# EAGLE design eprom-programmer3 (EAGLE 7.5.0)
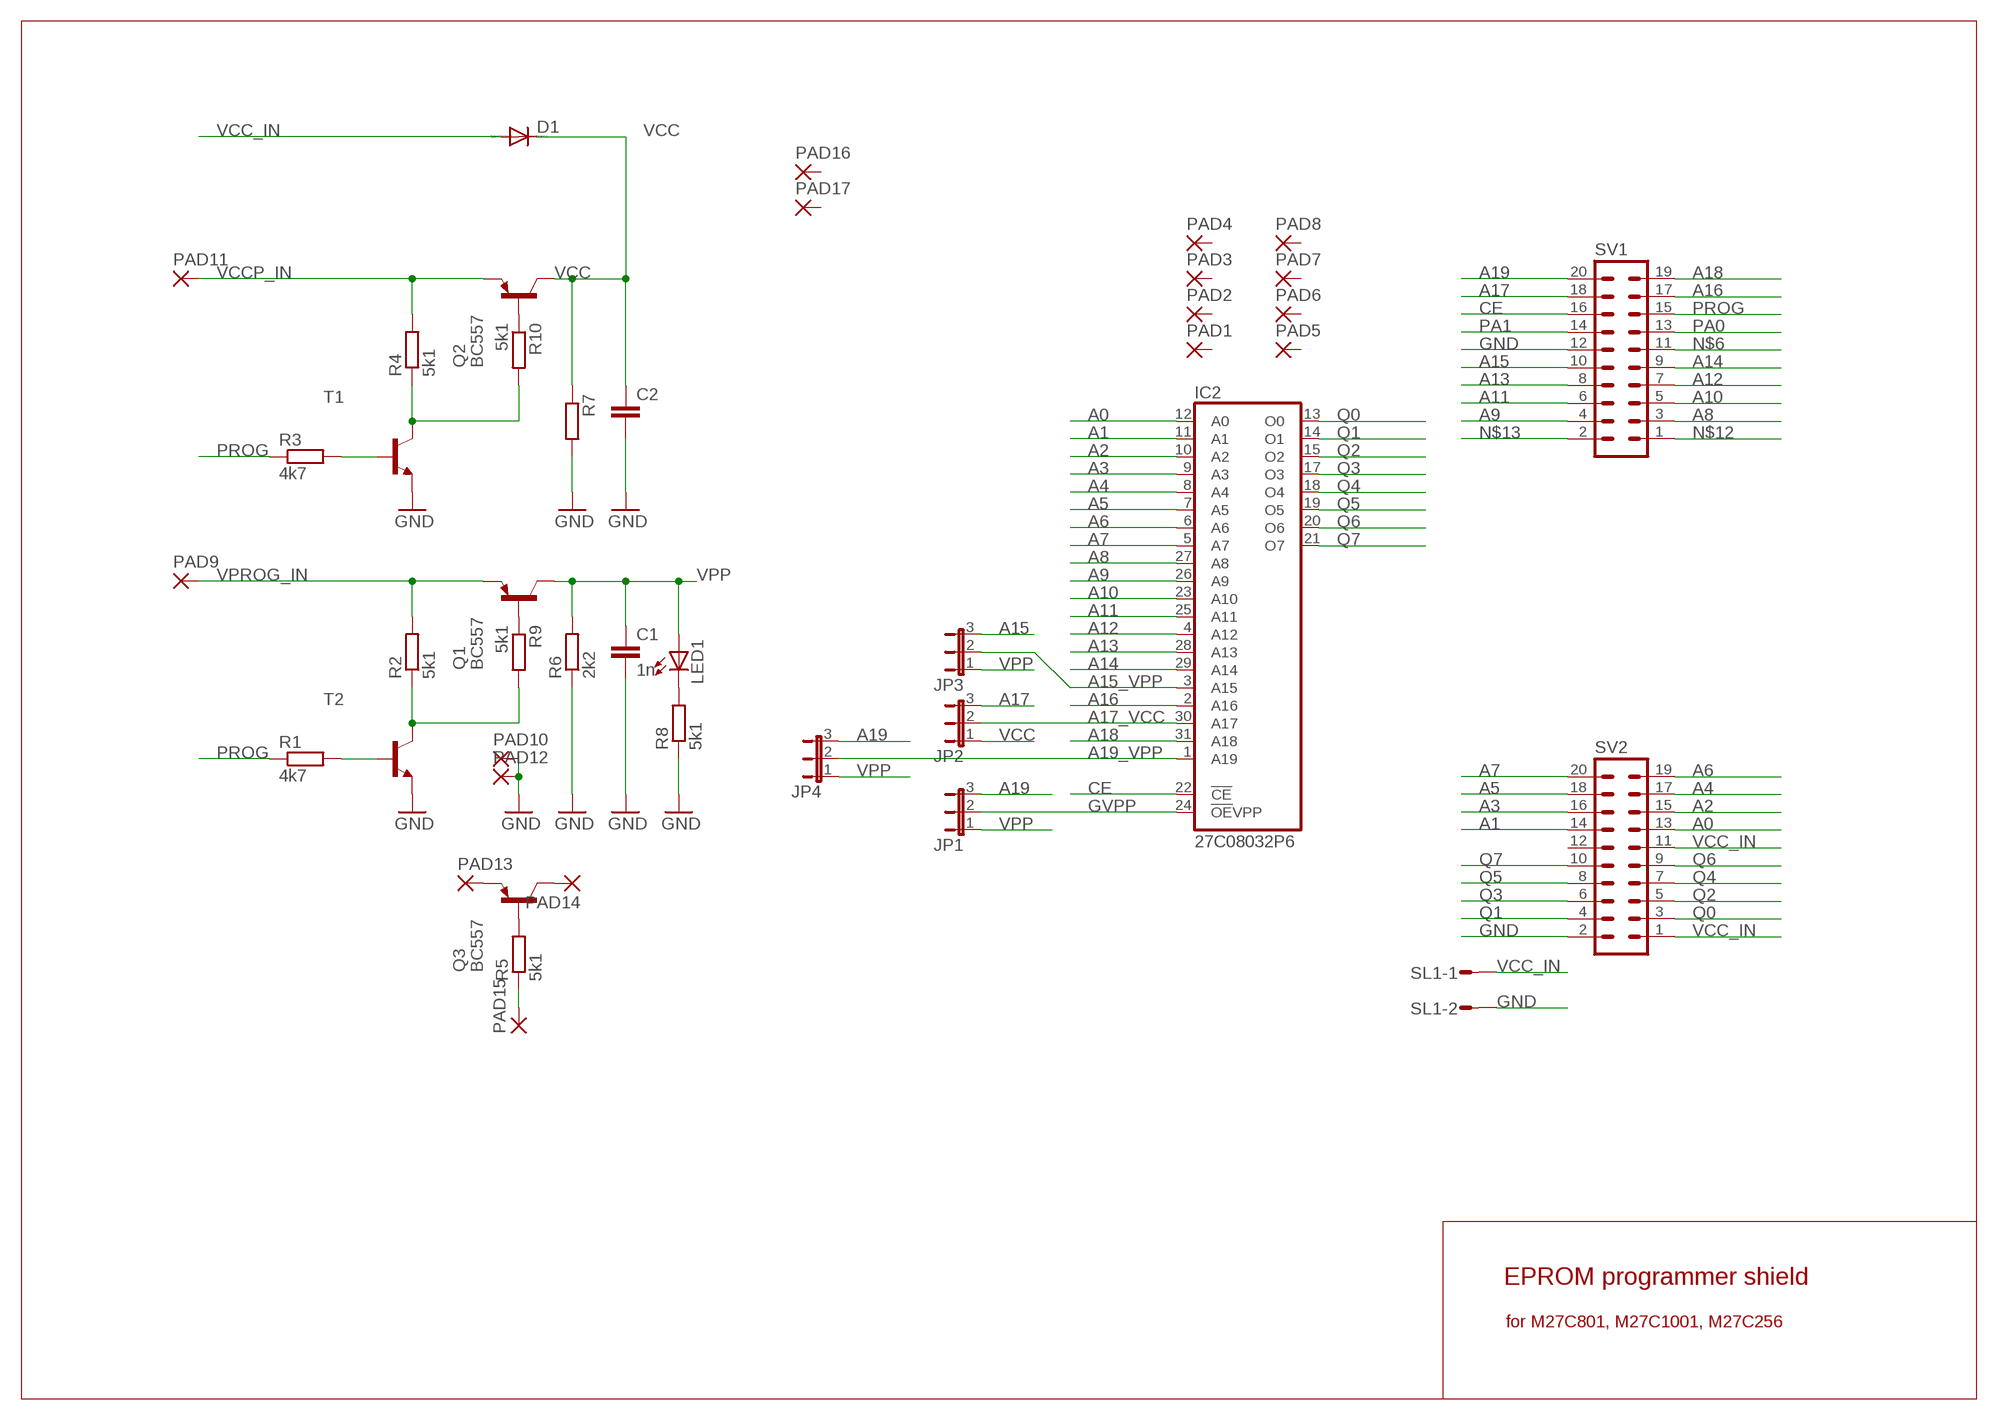
[diagram p0: schematic, sheet 1]

## Parts
C1  1n  C-EU025-024X044  [C025-024X044]
C2  C-EUC0805  [C0805]
D1  DIODE-MINIMELF  [MINIMELF]
IC2  27C08032P6  [DIL32]
JP1  JP2E  [JP2]
JP2  JP2E  [JP2]
JP3  JP2E  [JP2]
JP4  JP2E  [JP2]
LED1  LED3MM  [LED3MM]
PAD1  1,6/0,8  [1,6/0,8]
PAD2  1,6/0,8  [1,6/0,8]
PAD3  1,6/0,8  [1,6/0,8]
PAD4  1,6/0,8  [1,6/0,8]
PAD5  1,6/0,8  [1,6/0,8]
PAD6  1,6/0,8  [1,6/0,8]
PAD7  1,6/0,8  [1,6/0,8]
PAD8  1,6/0,8  [1,6/0,8]
PAD9  1,6/0,8  [1,6/0,8]
PAD10  1,6/0,8  [1,6/0,8]
PAD11  1,6/0,8  [1,6/0,8]
PAD12  1,6/0,8  [1,6/0,8]
PAD13  1,6/0,8  [1,6/0,8]
PAD14  1,6/0,8  [1,6/0,8]
PAD15  1,6/0,8  [1,6/0,8]
PAD16  1,6/0,8  [1,6/0,8]
PAD17  1,6/0,8  [1,6/0,8]
Q1  BC557  [TO92-EBC]
Q2  BC557  [TO92-EBC]
Q3  BC557  [TO92-EBC]
R1  4k7  R-EU_0207/2V  [0207/2V]
R2  5k1  R-EU_0207/2V  [0207/2V]
R3  4k7  R-EU_0207/2V  [0207/2V]
R4  5k1  R-EU_0207/2V  [0207/2V]
R5  5k1  R-EU_0207/2V  [0207/2V]
R6  2k2  R-EU_0207/2V  [0207/2V]
R7  R-EU_M0805  [M0805]
R8  5k1  R-EU_0207/2V  [0207/2V]
R9  5k1  R-EU_M0805  [M0805]
R10  5k1  R-EU_M0805  [M0805]
SL1  MA02S  [02PA]
SV1  MA10-2  [MA10-2]
SV2  MA10-2  [MA10-2]
T1  BC547-NPN-TO92-CBE  [TO92-CBE]
T2  BC547-NPN-TO92-CBE  [TO92-CBE]

## Nets
A0: IC2.12(A0) SV2.13
A1: IC2.11(A1) SV2.14
A2: IC2.10(A2) SV2.15
A3: IC2.9(A3) SV2.16
A4: IC2.8(A4) SV2.17
A5: IC2.7(A5) SV2.18
A6: IC2.6(A6) SV2.19
A7: IC2.5(A7) SV2.20
A8: IC2.27(A8) SV1.3
A9: IC2.26(A9) SV1.4
A10: IC2.23(A10) SV1.5
A11: IC2.25(A11) SV1.6
A12: IC2.4(A12) SV1.7
A13: IC2.28(A13) SV1.8
A14: IC2.29(A14) SV1.9
A15: JP3.3 SV1.10
A15_VPP: IC2.3(A15) JP3.2
A16: IC2.2(A16) SV1.17
A17: JP2.3 SV1.18
A17_VCC: IC2.30(A17) JP2.2
A18: IC2.31(A18) SV1.19
A19: JP1.3 JP4.3 SV1.20
A19_VPP: IC2.1(A19) JP4.2
CE: IC2.22(!CE) SV1.16
GND: C1.2 C2.2 PAD10.1(P) PAD12.1(P) R6.1 R7.2 R8.1 SL1.2 SV1.12 SV2.2 T1.E T2.E
GVPP: IC2.24(!OE!VPP) JP1.2
N$1: R3.2 T1.B
N$2: R4.1 R10.2 T1.C
N$3: R1.2 T2.B
N$4: R2.1 R9.2 T2.C
N$5: Q3.B R5.2
N$6: SV1.11
N$7: PAD13.1(P) Q3.E
N$8: PAD14.1(P) Q3.C
N$9: PAD15.1(P) R5.1
N$10: LED1.K(C) R8.2
N$11: Q1.B R9.1
N$12: SV1.1
N$13: SV1.2
N$14: Q2.B R10.1
PA0: SV1.13
PA1: SV1.14
PROG: R1.1 R3.1 SV1.15
Q0: IC2.13(O0) SV2.3
Q1: IC2.14(O1) SV2.4
Q2: IC2.15(O2) SV2.5
Q3: IC2.17(O3) SV2.6
Q4: IC2.18(O4) SV2.7
Q5: IC2.19(O5) SV2.8
Q6: IC2.20(O6) SV2.9
Q7: IC2.21(O7) SV2.10
VCC: C2.1 D1.C JP2.1 Q2.C R7.1
VCC_IN: D1.A SL1.1 SV2.1 SV2.11
VCCP_IN: PAD11.1(P) Q2.E R4.2
VPP: C1.1 JP1.1 JP3.1 JP4.1 LED1.A Q1.C R6.2
VPROG_IN: PAD9.1(P) Q1.E R2.2
Unconnected: PAD1.1(P) PAD2.1(P) PAD3.1(P) PAD4.1(P) PAD5.1(P) PAD6.1(P) PAD7.1(P) PAD8.1(P) PAD16.1(P) PAD17.1(P) SV2.12

## Notes on the sheet
- EPROM programmer shield
- for M27C801, M27C1001, M27C256

## Power pins joined to a net without a drawn wire
GND: IC2.16(GND)
VCC: IC2.32(VCC)

## Library data of the parts
C1 C2 = rcl:C-EU: CAPACITOR, European symbol
D1 = diode:DIODE-: DIODE
IC2 = atmel:27C080: 8-Megabit (1Mx8) OTP EPROM; MPN: AT27C080-90PU; OC_FARNELL: 1455026; OC_NEWARK: 58M3824
JP1-JP4 = jumper:JP2E: JUMPER
LED1 = led:LED: LED OSRAM: - CHIPLED LG R971, LG N971, LY N971, LG Q971, LY Q971, LO R971, LY R971 LH N974, LH R974 LS Q976, LO Q976, LY Q976 LO Q996 - Hyper CHIPLED LW Q18S LB Q993, LB Q99A, LB R99A - SideLED LS A670, LO A670, LY A670, LG A670, LP A670 LB A673, LV A673, LT A673, LW A673 LH A674 LY A675 LS A676, LA A676, LO A676, LY A676, LW A676 LS A679, LY A679, LG A679 - Hyper Micro SIDELED® LS Y876, LA Y876, LO Y876, LY Y876 LT Y87S - SmartLED LW L88C, LW L88S LB L89C, LB L89S, LG L890 LS L89K, LO L89K, LY L89K LS L896, LA L896, LO L896, LY L896 - TOPLED LS T670, LO T670, LY T670, LG T670, LP T670 LSG T670, LSP T670, LSY T670, LOP T670, LYG T670 LG T671, LOG T671, LSG T671 LB T673, LV T673, LT T673, LW T673 LH T674 LS T676, LA T676, LO T676, LY T676, LB T676, LH T676, LSB T676, LW T676 LB T67C, LV T67C, LT T67C, LS T67K, LO T67K, LY T67K, LW E67C LS E67B, LA E67B, LO E67B, LY E67B, LB E67C, LV E67C, LT E67C LW T67C LS T679, LY T679, LG T679 LS T770, LO T770, LY T770, LG T770, LP T770 LB T773, LV T773, LT T773, LW T773 LH T774 LS E675, LA E675, LY E675, LS T675 LS T776, LA T776, LO T776, LY T776, LB T776 LHGB T686 LT T68C, LB T68C - Hyper Mini TOPLED® LB M676 - Mini TOPLED Santana® LG M470 LS M47K, LO M47K, LY M47K Source: http://www.osram.convergy.de LUXEON: - LUMILED® LXK2-PW12-R00, LXK2-PW12-S00, LXK2-PW14-U00, LXK2-PW14-V00 LXK2-PM12-R00, LXK2-PM12-S00, LXK2-PM14-U00 LXK2-PE12-Q00, LXK2-PE12-R00, LXK2-PE12-S00, LXK2-PE14-T00, LXK2-PE14-U00 LXK2-PB12-K00, LXK2-PB12-L00, LXK2-PB12-M00, LXK2-PB14-N00, LXK2-PB14-P00, LXK2-PB14-Q00 LXK2-PR12-L00, LXK2-PR12-M00, LXK2-PR14-Q00, LXK2-PR14-R00 LXK2-PD12-Q00, LXK2-PD12-R00, LXK2-PD12-S00 LXK2-PH12-R00, LXK2-PH12-S00 LXK2-PL12-P00, LXK2-PL12-Q00, LXK2-PL12-R00 Source: www.luxeon.com KINGBRIGHT: KA-3528ASYC Source: www.kingbright.com
PAD1-PAD17 = wirepad:1,6/0,8: THROUGH-HOLE PAD
Q1-Q3 = transistor-pnp:BC557*: PNP Transistror
R1-R10 = rcl:R-EU_: RESISTOR, European symbol
SL1 = con-amp-quick:MA02S: AMP QUICK CONNECTOR; OC_FARNELL: unknown; OC_NEWARK: unknown
SV1 SV2 = con-lstb:MA10-2: PIN HEADER; OC_FARNELL: unknown; OC_NEWARK: unknown
T1 T2 = transistor:*-NPN-: NPN Transistror BF959 corrected 2008.03.06

## Board
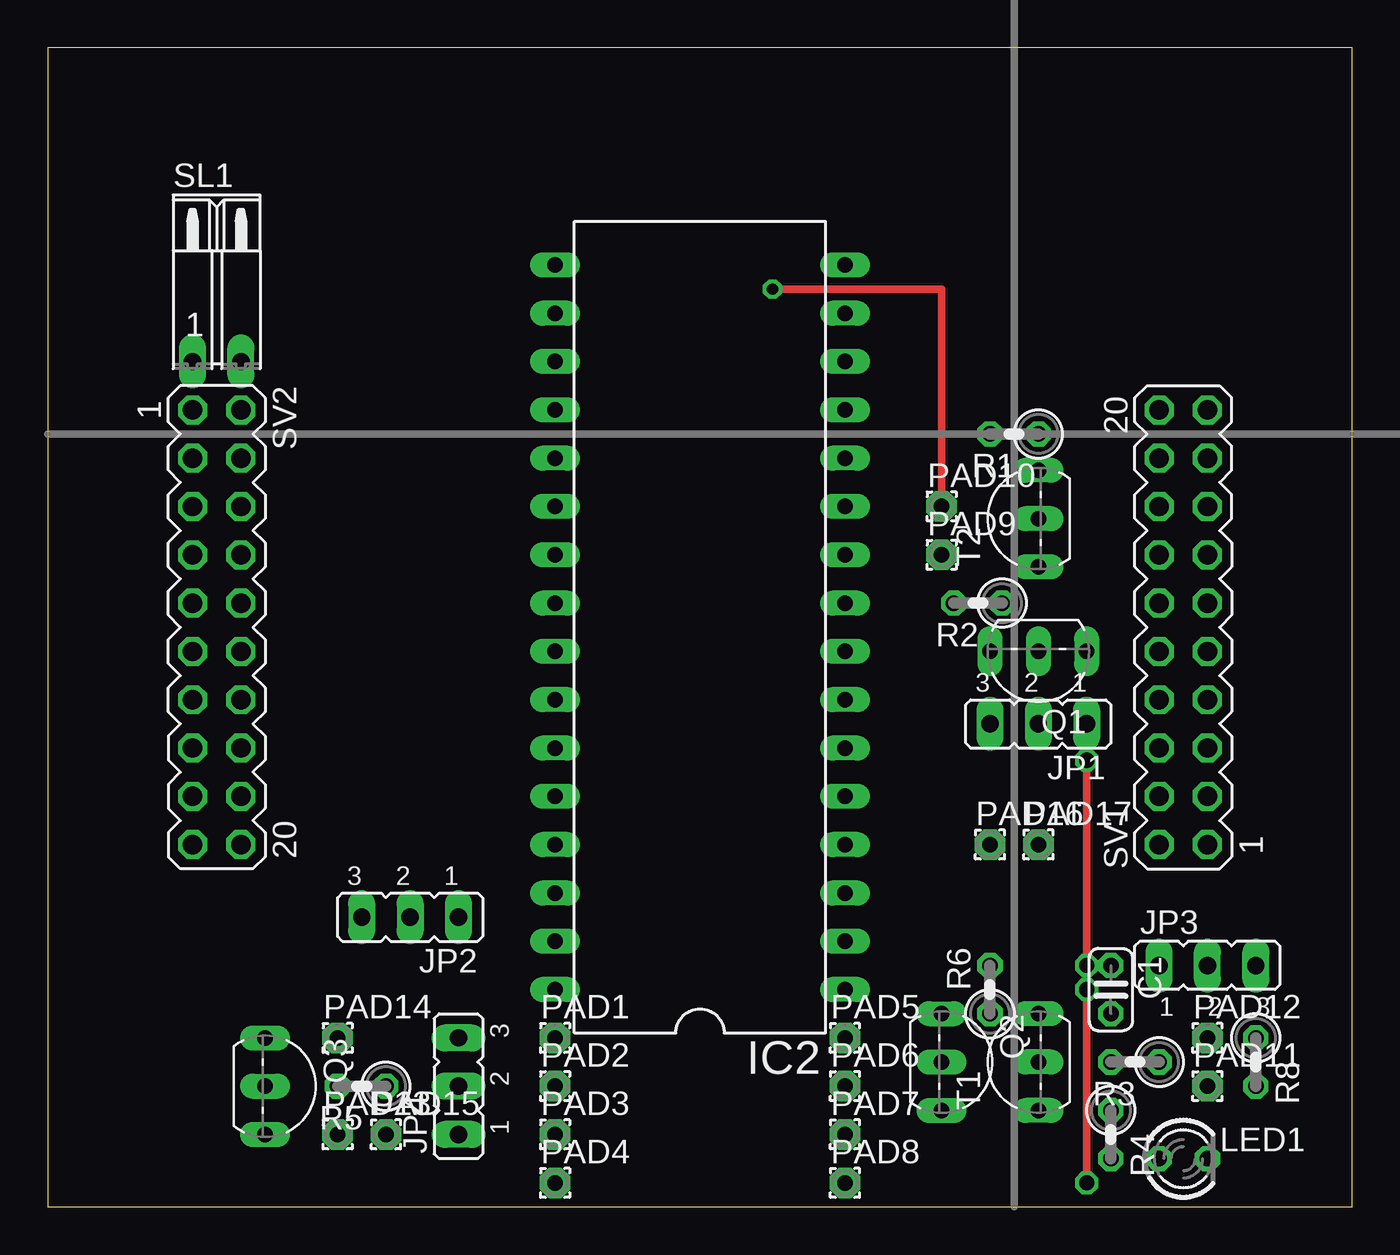
[diagram p1: board, top side]
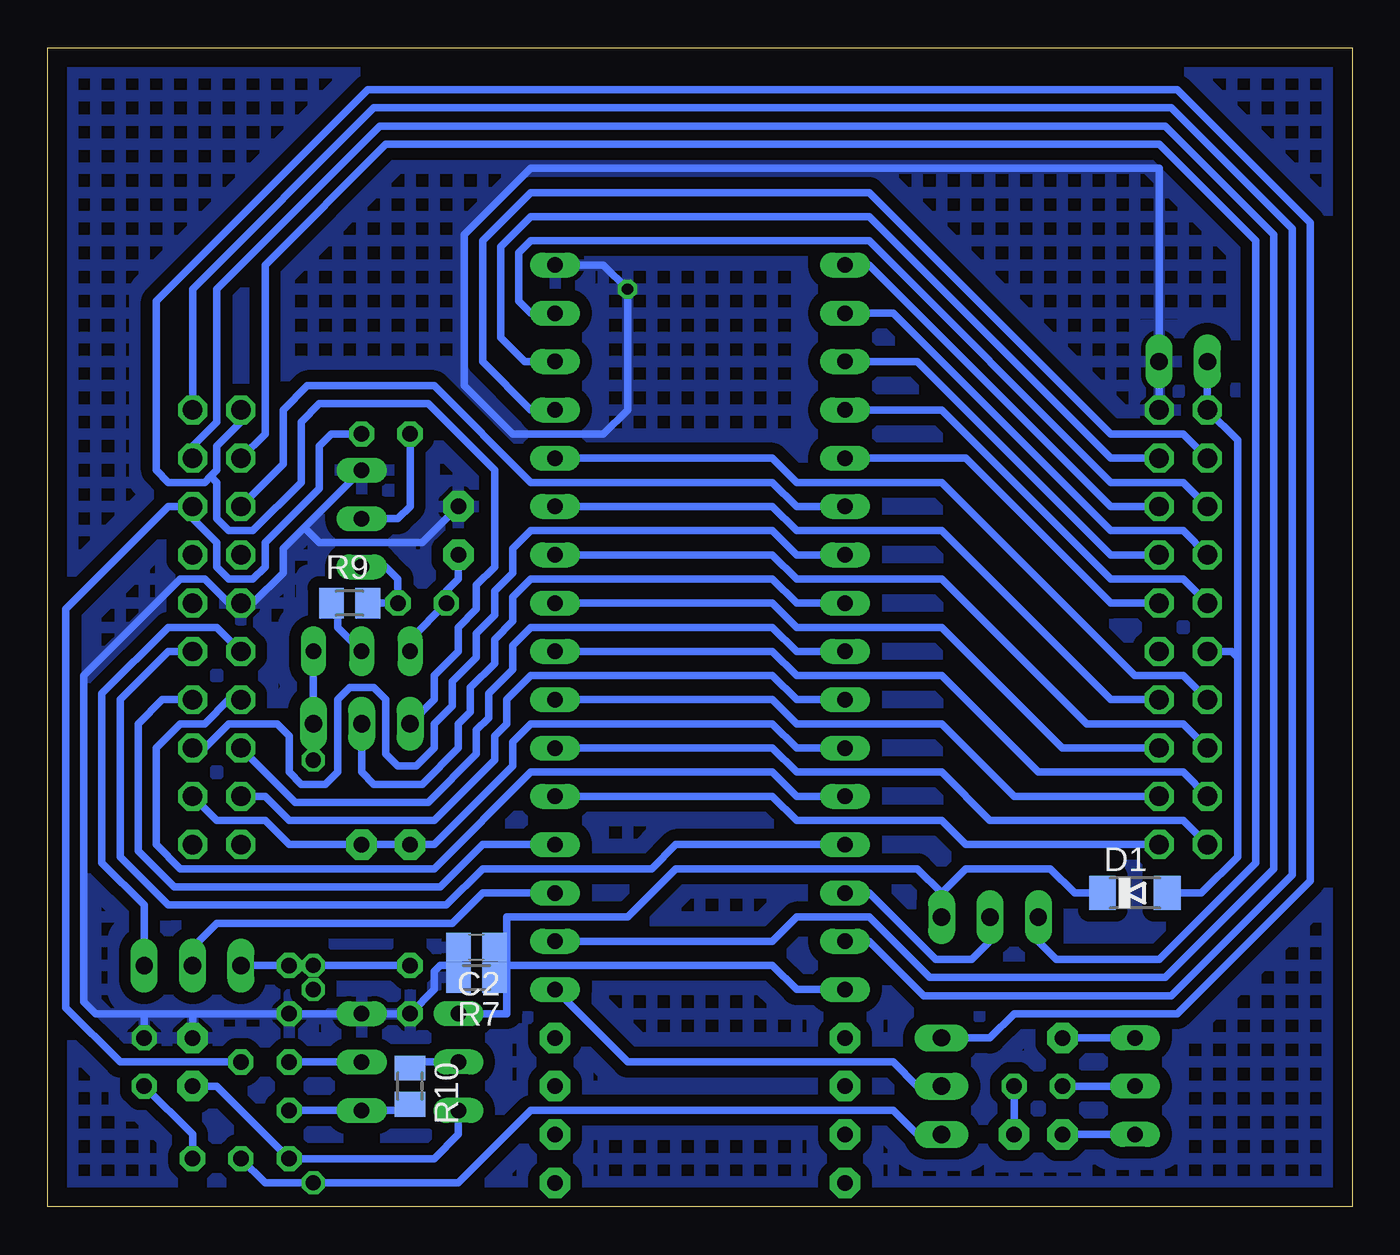
[diagram p2: board, bottom side, seen from below]

Size 68.58 x 60.96 mm. Coordinates in mm from the lower left corner, seen from the top.
Outline: 0,0 68.58,0 68.58,60.96 0,60.96 0,0
Copper layers (1*16): Top 0.035mm / dielectric 1.5mm / Bottom 0.035mm
Design rules "default": minimum track width 10mil, minimum drill 24mil, track to track 8mil, track to pad 8mil, pad to pad 8mil, via to via 8mil, smd to smd 8mil, copper to edge 40mil, drill to drill 8mil, minimum pad ring 10mil, minimum via ring 8mil, stop-mask expansion 4mil, vias tented up to drill 0mil, thermal gap 10mil
tKeepout: 4 lines

### Footprints (pad centres in the part's own frame; a part is rotated, then mirrored left to right if it is on the bottom)
C025-024X044 = drill 0.813 octagon: 1 -1.27,0; 2 1.27,0
C0805 = smd 1.3 x 1.5: 1 -0.95,0; 2 0.95,0
MINIMELF = smd 1.4 x 1.8: A 1.7,0; C -1.7,0
DIL32 = drill 0.813 long: 1 -19.05,-7.62; 2 -16.51,-7.62; 3 -13.97,-7.62; 4 -11.43,-7.62; 5 -8.89,-7.62; 6 -6.35,-7.62; 7 -3.81,-7.62; 8 -1.27,-7.62; 9 1.27,-7.62; 10 3.81,-7.62; 11 6.35,-7.62; 12 8.89,-7.62; 13 11.43,-7.62; 14 13.97,-7.62; 15 16.51,-7.62; 16 19.05,-7.62; 17 19.05,7.62; 18 16.51,7.62; 19 13.97,7.62; 20 11.43,7.62; 21 8.89,7.62; 22 6.35,7.62; 23 3.81,7.62; 24 1.27,7.62; 25 -1.27,7.62; 26 -3.81,7.62; 27 -6.35,7.62; 28 -8.89,7.62; 29 -11.43,7.62; 30 -13.97,7.62; 31 -16.51,7.62; 32 -19.05,7.62
JP2 = drill 0.914 long: 1 -2.54,0; 2 0,0; 3 2.54,0
LED3MM = drill 0.813 octagon: A -1.27,0; K 1.27,0
1,6/0,8 = drill 0.813 pad 1.6 octagon: 1 0,0
TO92-EBC = drill 0.813 long: B 0,-1.27; C -2.54,-1.27; E 2.54,-1.27
0207/2V = drill 0.813 octagon: 1 -1.27,0; 2 1.27,0
M0805 = smd 1.3 x 1.6: 1 -0.95,0; 2 0.95,0
02PA = drill 0.914 long: 1 -1.27,0; 2 1.27,0
MA10-2 = drill 1.016 octagon: 1 -11.43,-1.27; 2 -11.43,1.27; 3 -8.89,-1.27; 4 -8.89,1.27; 5 -6.35,-1.27; 6 -6.35,1.27; 7 -3.81,-1.27; 8 -3.81,1.27; 9 -1.27,-1.27; 10 -1.27,1.27; 11 1.27,-1.27; 12 1.27,1.27; 13 3.81,-1.27; 14 3.81,1.27; 15 6.35,-1.27; 16 6.35,1.27; 17 8.89,-1.27; 18 8.89,1.27; 19 11.43,-1.27; 20 11.43,1.27
TO92-CBE = drill 0.813 long: B 0,0; C -2.54,0; E 2.54,0

### Placement (x,y rotation side)
C1  55.88,11.43 270 top
C2  46.04,13.65 180 bottom
D1  11.43,16.51 0 bottom
IC2  34.29,30.48 90 top
JP1  52.07,25.4 180 top
JP2  19.05,15.24 180 top
JP3  60.96,12.7 0 top
JP4  21.59,6.35 90 top
LED1  59.69,2.54 0 top
PAD1  26.67,8.89 0 top
PAD2  26.67,6.35 0 top
PAD3  26.67,3.81 0 top
PAD4  26.67,1.27 0 top
PAD5  41.91,8.89 0 top
PAD6  41.91,6.35 0 top
PAD7  41.91,3.81 0 top
PAD8  41.91,1.27 0 top
PAD9  46.99,34.29 0 top
PAD10  46.99,36.83 0 top
PAD11  60.96,6.35 0 top
PAD12  60.96,8.89 0 top
PAD13  15.24,3.81 0 top
PAD14  15.24,8.89 0 top
PAD15  17.78,3.81 0 top
PAD16  49.53,19.05 0 top
PAD17  52.07,19.05 0 top
Q1  52.07,27.94 180 top
Q2  48.26,7.62 270 top
Q3  12.7,6.35 270 top
R1  50.8,40.64 180 top
R2  48.9,31.75 180 top
R3  57.15,7.62 180 top
R4  55.88,3.81 270 top
R5  16.51,6.35 180 top
R6  49.53,11.43 90 top
R7  46.04,12.06 180 bottom
R8  63.5,7.62 270 top
R9  52.7,31.75 0 bottom
R10  49.53,6.35 270 bottom
SL1  8.89,44.45 0 top
SV1  59.69,30.48 90 top
SV2  8.89,30.48 270 top
T1  52.07,7.62 90 top
T2  52.07,36.2 90 top

### Tracks (layer width: path | path; a pad name or v marks a point on that pad's centre or on a via)
A0
  Bottom 0.406: IC2.12 30.48,39.37 29.21,38.1 21.59,38.1 11.43,27.94 8.89,27.94 SV2.13
A1
  Bottom 0.406: SV2.14 12.7,26.67 21.59,35.56 29.21,35.56 30.48,36.83 IC2.11
A2
  Bottom 0.406: SV2.15 8.89,25.4 13.97,25.4 21.59,33.02 29.21,33.02 30.48,34.29 IC2.10
A3
  Bottom 0.406: SV2.16 15.24,24.13 21.59,30.48 29.21,30.48 30.48,31.75 IC2.9
A4
  Bottom 0.406: SV2.17 8.89,22.86 16.51,22.86 21.59,27.94 29.21,27.94 30.48,29.21 IC2.8
A5
  Bottom 0.406: SV2.18 17.78,21.59 21.59,25.4 29.21,25.4 30.48,26.67 IC2.7
A6
  Bottom 0.406: SV2.19 8.89,20.32 19.05,20.32 21.59,22.86 29.21,22.86 30.48,24.13 IC2.6
A7
  Bottom 0.406: SV2.20 20.32,19.05 21.59,20.32 29.21,20.32 30.48,21.59 IC2.5
A8
  Bottom 0.406: IC2.27 29.21,24.13 30.48,25.4 43.18,25.4 44.13,24.45 44.13,23.18 48.26,19.05 55.88,19.05 57.15,20.32 59.69,20.32 SV1.3
A9
  Bottom 0.406: IC2.26 29.21,26.67 30.48,27.94 43.18,27.94 44.45,26.67 44.45,25.4 45.09,24.77 45.09,23.5 48.26,20.32 55.88,20.32 57.15,21.59 SV1.4
A10
  Bottom 0.406: IC2.23 29.21,34.29 30.48,35.56 43.18,35.56 44.13,34.61 44.13,33.34 45.09,32.38 45.09,31.11 46.04,30.16 46.04,28.89 47.31,27.62 47.31,26.35 48.26,25.4 48.26,24.13 49.21,23.18 50.16,23.18 50.8,23.81 50.8,26.67 51.44,27.3 52.7,27.3 53.34,26.67 53.34,22.86 53.98,22.23 55.24,22.23 55.88,22.86 55.88,24.77 56.52,25.4 59.05,25.4 60.33,24.13 SV1.5
A11
  Bottom 0.406: IC2.25 29.21,29.21 30.48,30.48 43.18,30.48 44.13,29.53 44.13,28.26 45.4,26.99 45.4,25.72 46.04,25.08 46.04,23.81 48.58,21.27 55.56,21.27 SV1.6
A12
  Bottom 0.406: SV1.7 62.55,26.67 63.82,25.4 63.82,18.73 61.91,16.83 47.94,16.83 45.72,19.05 IC2.4
A13
  Bottom 0.406: IC2.28 29.21,21.59 30.48,22.86 43.18,22.86 48.26,17.78 61.59,17.78 62.87,19.05 62.87,24.13 61.59,25.4 60.33,25.4 59.05,26.67 SV1.8
A14
  Bottom 0.406: IC2.29 35.56,19.05 36.83,17.78 45.72,17.78 47.62,15.88 62.23,15.88 64.77,18.41 64.77,26.67 62.23,29.21 SV1.9
A15
  Bottom 0.406: SV1.10 59.69,30.48 62.23,30.48 65.72,26.99 65.72,18.1 63.5,15.88 JP3.3
A15_VPP
  Bottom 0.406: IC2.3 45.72,16.51 47.31,14.92 59.69,14.92 60.96,13.65 JP3.2
A16
  Bottom 0.406: IC2.2 30.48,13.97 29.21,15.24 25.4,15.24 22.23,12.06 9.84,12.06 4.13,17.78 4.13,51.12 9.84,56.83 51.12,56.83 59.69,48.26 59.69,41.27 60.96,40.01 SV1.17
A17
  Bottom 0.406: SV1.18 57.15,40.64 57.15,49.53 50.8,55.88 10.16,55.88 5.08,50.8 5.08,18.1 10.16,13.02 15.56,13.02 16.51,13.97 JP2.3
A17_VCC
  Bottom 0.406: IC2.30 25.4,16.51 21.91,13.02 20,13.02 19.05,13.97 JP2.2
A18
  Bottom 0.406: SV1.19 60.96,48.26 51.44,57.78 9.53,57.78 3.17,51.44 3.17,17.46 9.53,11.11 22.54,11.11 25.4,13.97 IC2.31
A19
  Bottom 0.406: SV1.20 58.42,41.27 59.69,40.01 59.69,38.73 60.01,38.42 | 60.01,38.42 60.33,38.1 62.23,38.1 62.87,38.73 62.87,47.62 51.75,58.74 9.21,58.74 2.22,51.75 2.22,17.14 9.21,10.16 17.78,10.16 19.05,8.89 JP4.3 | JP1.3 48.26,26.67 48.26,27.94 46.99,29.21 46.99,30.48 46.04,31.43 46.04,32.7 45.09,33.66 45.09,38.73 48.58,42.23 54.29,42.23 55.24,41.27 55.24,38.1 57.78,35.56 59.05,35.56 59.69,36.2 59.69,38.1 60.01,38.42
A19_VPP
  Bottom 0.406: IC2.1 38.1,7.62 24.13,7.62 22.86,6.35 JP4.2
CE
  Bottom 0.406: IC2.22 29.21,36.83 30.48,38.1 43.18,38.1 48.26,43.18 54.93,43.18 56.2,41.91 56.2,39.05 SV1.16
GND  (via drill 0.6)
  Top 0.406: PAD10.1 46.99,48.26 v38.1,48.26
  Bottom 0.406: IC2.16 39.37,49.53 v38.1,48.26 38.1,41.91 39.37,40.64 44.13,40.64 46.67,43.18 46.67,51.12 43.18,54.61 10.16,54.61 SL1.2 SV2.2 | T2.E 55.09,35.72 | 55.09,35.72 56.2,34.61 56.2,33.34 57.78,31.75 SV1.12 59.05,31.75 60.33,33.02 61.59,33.02 66.67,27.94 66.67,10.79 66.04,10.16 63.5,10.16 | PAD10.1 48.9,34.92 54.29,34.92 55.09,35.72 | 63.5,10.16 60.96,10.16 | 60.96,10.16 C1.2 T1.E R6.1 48.26,11.43 48.26,12.38 47.94,12.7 46.99,12.7 | PAD12.1 60.96,10.16 | C2.2 46.99,12.7 | 46.99,12.7 R7.2 | R8.1 63.5,10.16
  pour Bottom (isolate 0.61, hatched): 0,0 68.58,0 68.58,60.96 0,60.96
GVPP
  Bottom 0.406: IC2.24 29.21,31.75 30.48,33.02 43.18,33.02 44.13,32.07 44.13,30.8 45.09,29.84 45.09,28.57 46.35,27.3 46.35,26.04 46.99,25.4 46.99,24.13 48.9,22.23 51.44,22.23 52.07,22.86 JP1.2
N$1
  Bottom 0.406: T1.B R3.2
N$2
  Bottom 0.406: R4.1 T1.C 49.53,5.08 R10.2
N$3
  Bottom 0.406: T2.B 50.16,36.2 49.53,36.83 R1.2
N$4
  Bottom 0.406: T2.C 50.8,33.66 50.16,33.02 R2.1 R9.2
N$5
  Bottom 0.406: Q3.B R5.2
N$7
  Bottom 0.406: Q3.E PAD13.1
N$8
  Bottom 0.406: Q3.C PAD14.1
N$9
  Bottom 0.406: R5.1 PAD15.1
N$10
  Bottom 0.406: LED1.K 60.96,3.81 R8.2
N$11
  Bottom 0.406: R9.1 53.34,31.43 53.34,30.48 Q1.B
N$14
  Bottom 0.406: Q2.B 49.53,7.62 R10.1
PROG
  Bottom 0.406: R1.1 53.66,40.64 54.29,40.01 54.29,37.78 57.15,34.92 57.15,33.66 57.78,33.02 59.05,33.02 59.69,33.66 59.69,34.92 60.96,36.2 SV1.15 62.23,36.83 67.63,31.43 67.63,10.48 64.77,7.62 R3.1
Q0
  Bottom 0.406: SV2.3 8.89,40.64 12.7,40.64 25.4,53.34 43.18,53.34 45.72,50.8 45.72,44.45 43.18,41.91 IC2.13
Q1
  Bottom 0.406: SV2.4 12.7,39.37 25.4,52.07 43.18,52.07 44.77,50.48 44.77,45.72 43.5,44.45 IC2.14
Q2
  Bottom 0.406: SV2.5 8.89,38.1 12.7,38.1 25.4,50.8 43.18,50.8 43.81,50.16 43.81,47.62 43.18,46.99 IC2.15
Q3
  Bottom 0.406: SV2.6 12.7,36.83 25.4,49.53 IC2.17
Q4
  Bottom 0.406: SV2.7 8.89,35.56 12.7,35.56 24.13,46.99 IC2.18
Q5
  Bottom 0.406: SV2.8 12.7,34.29 22.86,44.45 IC2.19
Q6
  Bottom 0.406: SV2.9 8.89,33.02 12.7,33.02 21.59,41.91 IC2.20
Q7
  Bottom 0.406: SV2.10 12.7,31.75 20.32,39.37 IC2.21
VCC
  Bottom 0.406: IC2.32 29.21,11.43 30.48,12.7 44.45,12.7 | 44.45,12.7 44.45,15.24 38.1,15.24 35.56,17.78 22.86,17.78 21.59,16.51 | D1.C 14.61,16.51 15.88,17.78 20.32,17.78 21.59,16.51 | 21.59,16.51 JP2.1 | 44.45,12.7 44.45,10.16 Q2.C | C2.1 45.09,13.34 44.45,12.7 | R7.1 44.45,12.7
VCC_IN
  Bottom 0.406: SL1.1 SV2.1 6.03,40.32 6.03,28.89 | 6.03,28.89 6.03,18.41 7.94,16.51 D1.A | SV2.11 6.35,29.21 6.03,28.89
VCCP_IN
  Bottom 0.406: Q2.E 46.99,3.81 48.26,2.54 R4.2 59.69,6.35 PAD11.1
VPP  (via drill 0.8)
  Top 0.406: v54.61,23.5 v54.61,12.7 v54.61,11.43 v54.61,1.27
  Bottom 0.406: Q1.C JP1.1 v54.61,23.5 | JP3.1 C1.1 v54.61,12.7 R6.2 | JP4.1 22.86,3.81 24.13,5.08 43.18,5.08 46.99,1.27 v54.61,1.27 57.15,1.27 LED1.A
VPROG_IN
  Bottom 0.406: PAD9.1 46.99,33.02 47.62,32.38 R2.2 49.53,29.84 Q1.E

### Text on the board
Document: ALIGN NON-1 PIN END HERE | VCC | GND | A | V | JP4 | A | A | V | JP3 | GND | A | V | JP2 | EPROM PROGRAMMER | V | A | A | JP1 | VPROG | A | V | C801 | C1001 | C256 | JP1 | V_ID | JP2 | JP3 | V | A | A | V | A | JP4 | VCC | HI | V